# EAGLE design Nightlight Fan (EAGLE 8.4.3)
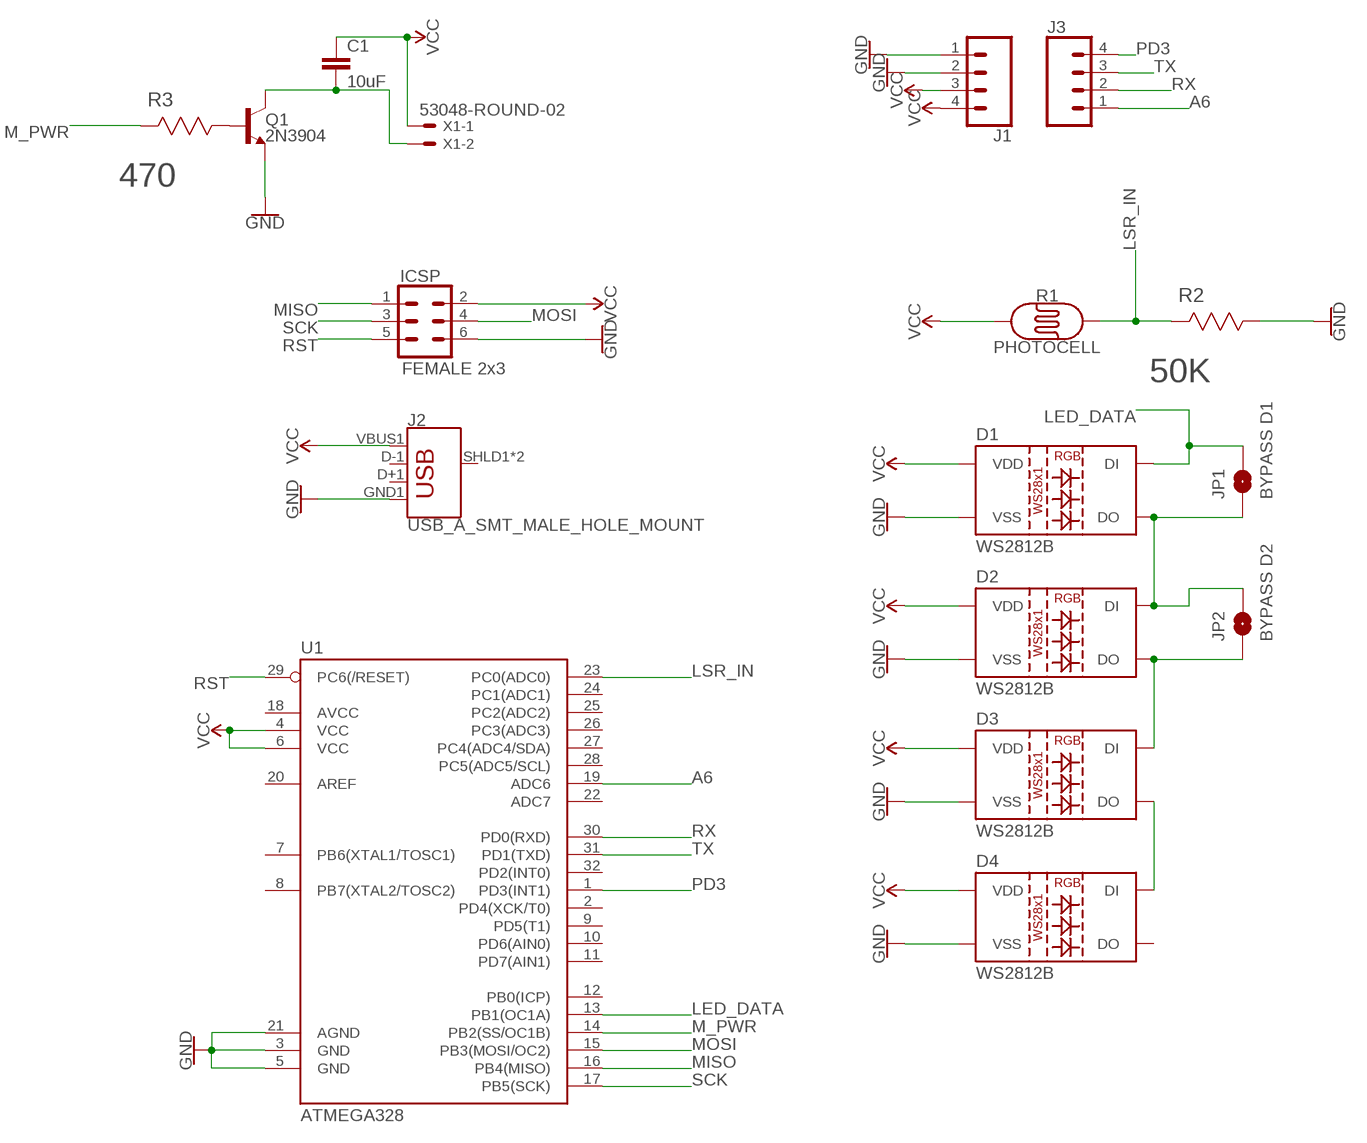
[diagram p0: schematic, sheet 1]

## Parts
C1  10uF  10UF-0805-10V-10%  [0805]
D1  WS2812B  [WS2812B]
D2  WS2812B  [WS2812B]
D3  WS2812B  [WS2812B]
D4  WS2812B  [WS2812B]
ICSP  FEMALE 2x3  CONN_03X22X3_SILK_MALE_PTH  [2X3]
J1  CONN_041X04_NO_SILK  [1X04_NO_SILK]
J2  USB_A_SMT_MALE_HOLE_MOUNT  [USB_A_SMT_MALE]
J3  CONN_041X04_NO_SILK  [1X04_NO_SILK]
JP1  BYPASS D1  JUMPER-SMT_2_NO_SILK  [SMT-JUMPER_2_NO_SILK]
JP2  BYPASS D2  JUMPER-SMT_2_NO_SILK  [SMT-JUMPER_2_NO_SILK]
Q1  2N3904  TRANS_NPN-MMBT2222AL  [SOT23-3]
R1  PHOTOCELL  PHOTOCELLPTH  [PHOTOCELL]
R2  50K  CRCW080510K0FKEA  [RESC2013X65N]
R3  470  CRCW0805470RFKEA  [RESC2013X65N]
U1  ATMEGA328  ATMEGA328P_TQFP  [TQFP32-08]
X1  53048-ROUND-02  [53048-02]

## Nets
A6: J3.1 U1.19(ADC6)
GND: D1.3(VSS) D2.3(VSS) D3.3(VSS) D4.3(VSS) ICSP.6 J1.1 J1.2 J2.GND1(GND) Q1.2(E) R2.1 U1.3(GND) U1.5(GND) U1.21(AGND)
LED_DATA: D1.4(DI) JP1.2 U1.13(PB1(OC1A))
LSR_IN: R1.2 R2.2 U1.23(PC0(ADC0))
M_PWR: R3.2 U1.14(PB2(SS/OC1B))
MISO: ICSP.1 U1.16(PB4(MISO))
MOSI: ICSP.4 U1.15(PB3(MOSI/OC2))
N$1: D1.2(DO) D2.4(DI) JP1.1 JP2.2
N$2: D2.2(DO) D3.4(DI) JP2.1
N$3: D3.2(DO) D4.4(DI)
N$4: Q1.1(B) R3.1
N$5: C1.2 Q1.3(C) X1.2
PD3: J3.4 U1.1(PD3(INT1))
RST: ICSP.5 U1.29(PC6(/RESET))
RX: J3.2 U1.30(PD0(RXD))
SCK: ICSP.3 U1.17(PB5(SCK))
TX: J3.3 U1.31(PD1(TXD))
VCC: C1.1 D1.1(VDD) D2.1(VDD) D3.1(VDD) D4.1(VDD) ICSP.2 J1.3 J1.4 J2.VBUS1(VBUS) R1.1 U1.4(VCC) U1.6(VCC) X1.1
Unconnected: D4.2(DO) J2.D+1(D+) J2.D-1(D-) J2.SHLD1(SHIELD) J2.SHLD2(SHIELD) U1.2(PD4(XCK/T0)) U1.7(PB6(XTAL1/TOSC1)) U1.8(PB7(XTAL2/TOSC2)) U1.9(PD5(T1)) U1.10(PD6(AIN0)) U1.11(PD7(AIN1)) U1.12(PB0(ICP)) U1.18(AVCC) U1.20(AREF) U1.22(ADC7) U1.24(PC1(ADC1)) U1.25(PC2(ADC2)) U1.26(PC3(ADC3)) U1.27(PC4(ADC4/SDA)) U1.28(PC5(ADC5/SCL)) U1.32(PD2(INT0))

## Library data of the parts
C1 = SparkFun-Capacitors:10UF: 10.0µF ceramic capacitors A capacitor is a passive two-terminal electrical component used to store electrical energy temporarily in an electric field.; PROD_ID: CAP-11330
D1-D4 = SparkFun-LED:WS2812B: WS2812B SMD addressable RGB LED 5x5mm SMD LED with built-in controller IC. Color: Red/Green/Blue mC Rating: RGB: 390, 660, 180 mcd Forward Voltage: RGB: 2.0, 3.0, 3.0 V Packages:WS2812B SparkFun Products: Blynk Board - ESP8266 <https://www.sparkfun.com/products/13794>; PROD_ID: DIO-12503
ICSP = SparkFun-Connectors:CONN_03X2: Multi connection point. Often used as Generic Header-pin footprint for 0.1 inch spaced/style header connections You can populate with any combo of single row headers, but if you'd like an exact match, check these: Header - 2x3 (Male, 0.1") <https://www.sparkfun.com/products/12807> (PRT-12807) Header - 2x3 (Female, 0.1") <https://www.sparkfun.com/products/13010> (PRT-13010) 2x3 Pin Shrouded Header <https://www.sparkfun.com/products/10877> (PRT-10877) On any of the 0.1 inch spaced packages, you can populate with these: Break Away Headers - Straight <https://www.sparkfun.com/products/116> (PRT-00116) Break Away Male Headers - Right Angle <https://www.sparkfun.com/products/553> (PRT-00553) Female Headers <https://www.sparkfun.com/products/115> (PRT-00115) Break Away Headers - Machine Pin <https://www.sparkfun.com/products/117> (PRT-00117) Break Away Female Headers - Swiss Machine Pin <https://www.sparkfun.com/products/743> (PRT-00743) Special note: the shrouded connector mates well with our 3x2 ribbon cables: Ribbon Crimp Connector - 6-pin (2x3, Female) <https://www.sparkfun.com/products/10651> (PRT-10651) Ribbon Cable - 6 wire (15ft) <https://www.sparkfun.com/products/10646> (PRT-10646); PROD_ID: CONN-09701
J1 J3 = SparkFun-Connectors:CONN_04: Multi connection point. Often used as Generic Header-pin footprint for 0.1 inch spaced/style header connections On any of the 0.1 inch spaced packages, you can populate with these: Break Away Headers - Straight <https://www.sparkfun.com/products/116> (PRT-00116) Break Away Male Headers - Right Angle <https://www.sparkfun.com/products/553> (PRT-00553) Female Headers <https://www.sparkfun.com/products/115> (PRT-00115) Break Away Headers - Machine Pin <https://www.sparkfun.com/products/117> (PRT-00117) Break Away Female Headers - Swiss Machine Pin <https://www.sparkfun.com/products/743> (PRT-00743) For SCREWTERMINALS and SPRING TERMINALS visit here: Screw Terimnals on SparkFun.com <https://www.sparkfun.com/search/results?term=Screw+Terminals> (5mm/3.5mm/2.54mm spacing) This device is also useful as a general connection point to wire up your design to another part of your project. Our various solder wires solder well into these plated through hole pads. Hook-Up Wire - Assortment (Stranded, 22 AWG) <https://www.sparkfun.com/products/11375> (PRT-11375) Hook-Up Wire - Assortment (Solid Core, 22 AWG) <https://www.sparkfun.com/products/11367> (PRT-11367) View the entire wire category on our website here <https://www.sparkfun.com/categories/141> Special notes: Molex polarized connector foot print use with SKU : PRT-08231 with associated crimp pins and housings. 1MM SMD Version SKU: PRT-10208; PROD_ID: CONN-09696
J2 = !CustomParts:USB_A_SMT_MALE_
JP1 JP2 = SparkFun-Jumpers:JUMPER-SMT_2_NO: Normally open jumper This jumper has two pads in close proximity to each other. Apply solder to close the connection. Round pads are easier to solder for beginners, but are a lot larger. SparkFun Product that uses the round pads: SparkFun EL Sequencer <https://www.sparkfun.com/products/12781>
Q1 = SparkFun-DiscreteSemi:TRANS_NPN: NPN transistor Current controlled devices typically used to amplify current or used as a switch. BC547 - COM-08928 <http://www.sparkfun.com/products/8928> (TO-92 45V 100mA) (1.Collector 2.Base 3.Emitter) 2N3904 - COM-00521 <http://www.sparkfun.com/products/521> (TO-92 40V 200mA) (1.Emitter 2.Base 3.Collector) P2N2222A - COM-12852 <http://www.sparkfun.com/products/12852> (TO-92 40V 600mA) (1.Collector 2.Base 3.Emitter); PROD_ID: TRANS-08049; VALUE: 600mA/40V
R1 = SparkFun-Sensors:PHOTOCELL: Photocell (Photodetector, Photo Resistor, CdS) This is a very small light sensor. A photocell changes (also called a photodetector, photo resistor, CdS or photoconductive cell) resistance depending on the amount of light it is exposed to. These little sensors make great ambient light triggers (when light in the room turns on, do something). Datasheet <http://cdn.sparkfun.com/datasheets/Sensors/LightImaging/SEN-09088.pdf> SparkFun Products Mini Photocell <https://www.sparkfun.com/products/9088> (SEN-09088); PROD_ID: COMP-09129; SF_ID: SEN-09088
R2 = Vishay_By_element14_Batch_1:CRCW080510K0FKEA: RESISTOR, 0805; MPN: CRCW080510K0FKEA; OC_FARNELL: 1469856; OC_NEWARK: 52K9796; SUPPLIER: Vishay; TOLERANCE: ±1%; VALUE: 10K Ohms; WATTAGE: 0.125 W
R3 = Vishay_By_element14_Batch_1:CRCW0805470RFKEA: RESISTOR, 0805; MPN: CRCW0805470RFKEA; OC_FARNELL: 1469932; OC_NEWARK: 42K4556; SUPPLIER: Vishay; TOLERANCE: ±1%; VALUE: 470 Ohms; WATTAGE: 0.125 W
U1 = SparkFun-IC-Microcontroller:ATMEGA328P_TQFP: Popular 328P in QFP Storefront component: ATmega328 - TQFP <https://www.sparkfun.com/products/13448> (COM-13448) Datasheet <http://www.sparkfun.com/datasheets/Components/SMD/ATMega328.pdf> SparkFun Products SparkFun RedBoard - Programmed with Arduino <https://www.sparkfun.com/products/12757> (DEV-12757) Arduino Pro Mini 328 - 5V/16MHz <https://www.sparkfun.com/products/11113> (DEV-11113) Arduino Pro Mini 328 - 3.3V/8MHz <https://www.sparkfun.com/products/11114> (DEV-11114) SparkFun OpenLog <https://www.sparkfun.com/products/13712> (DEV-13712) SparkFun MicroView - OLED Arduino Module <https://www.sparkfun.com/products/12923> (DEV-12923) SparkFun Digital Sandbox <https://www.sparkfun.com/products/12651> (DEV-12651) SparkFun PicoBoard <https://www.sparkfun.com/products/11888> (WIG-11888) Arduino Fio <https://www.sparkfun.com/products/10116> (DEV-10116) LilyPad Arduino 328 Main Board <https://www.sparkfun.com/products/13342> (DEV-13342) SparkFun RedStick <https://www.sparkfun.com/products/13741> (DEV-13741) LilyPad MP3 <https://www.sparkfun.com/products/11013> (DEV-11013) LilyPad Arduino SimpleSnap <https://www.sparkfun.com/products/10941> (DEV-10941) SparkFun Stepoko <https://www.sparkfun.com/products/13899> (ROB-13899) SparkFun Geiger Counter <https://www.sparkfun.com/products/11345> (SEN-11345) SparkFun EL Sequencer <https://www.sparkfun.com/products/12781> (COM-12781) Arduino Pro 328 - 5V/16MHz <https://www.sparkfun.com/products/10915> (DEV-10915) CryptoCape <https://www.sparkfun.com/products/12773> (DEV-12773) SparkFun IR Thermometer Evaluation Board - MLX90614 <https://www.sparkfun.com/products/10740> (SEN-10740) SparkFun RedBot Mainboard <https://www.sparkfun.com/products/12097> (ROB-12097) Arduino Pro 328 - 3.3V/8MHz <https://www.sparkfun.com/products/10914> (DEV-10914) SparkFun Block for Intel® Edison - Arduino <https://www.sparkfun.com/products/13036> (DEV-13036) SparkFun Simon Says - Surface Mount Soldering Kit <https://www.sparkfun.com/products/10935> (KIT-10935) SparkFun 7-Segment Serial Display - Red <https://www.sparkfun.com/products/11441> (COM-11441) SparkFun 7-Segment Serial Display - White <https://www.sparkfun.com/products/11629> (COM-11629) SparkFun 7-Segment Serial Display - Yellow <https://www.sparkfun.com/products/11443> (COM-11443) SparkFun 7-Segment Serial Display - Kelly Green <https://www.sparkfun.com/products/11440> (COM-11440) SparkFun 7-Segment Serial Display - Blue <https://www.sparkfun.com/products/11442> (COM-11442) SparkFun OpenSegment Serial Display - 20mm (Blue) <https://www.sparkfun.com/products/11647> (COM-11647) SparkFun OpenSegment Serial Display - 20mm (Green) <https://www.sparkfun.com/products/11646> (COM-11646) SparkFun OpenSegment Serial Display - 20mm (White) <https://www.sparkfun.com/products/11648> (COM-11648) SparkFun OpenSegment Serial Display - 20mm (Red) <https://www.sparkfun.com/products/11644> (COM-11644) SparkFun OpenSegment Serial Display - 20mm (Yellow) <https://www.sparkfun.com/products/11645> (COM-11645) SparkFun OpenSegment Shield <https://www.sparkfun.com/products/13190> (DEV-13190); PROD_ID: IC-09069; VALUE: ATMEGA328P_TQFP
X1 = !CustomParts:53?-02: CONNECTOR wire to board 1.25 mm (.049 inch) pitch header; MF: MOLEX; MPN: 53048-0210; OC_FARNELL: 1012259; OC_NEWARK: 57H4718

## Board
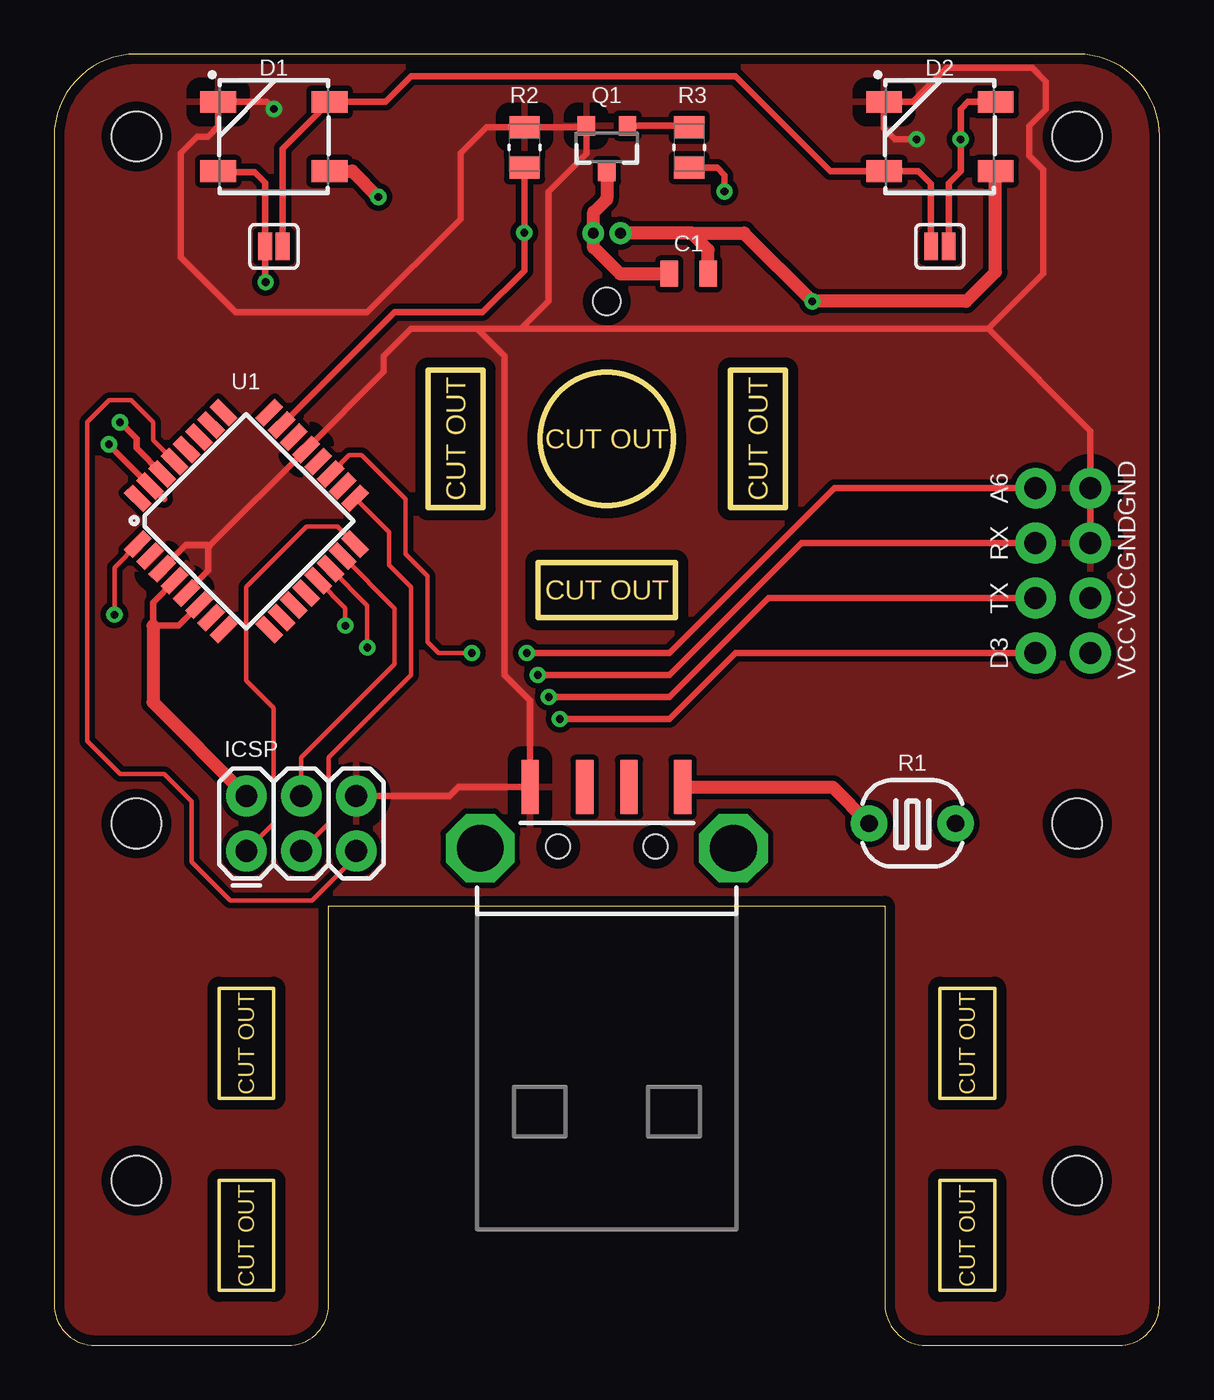
[diagram p1: board, top side]
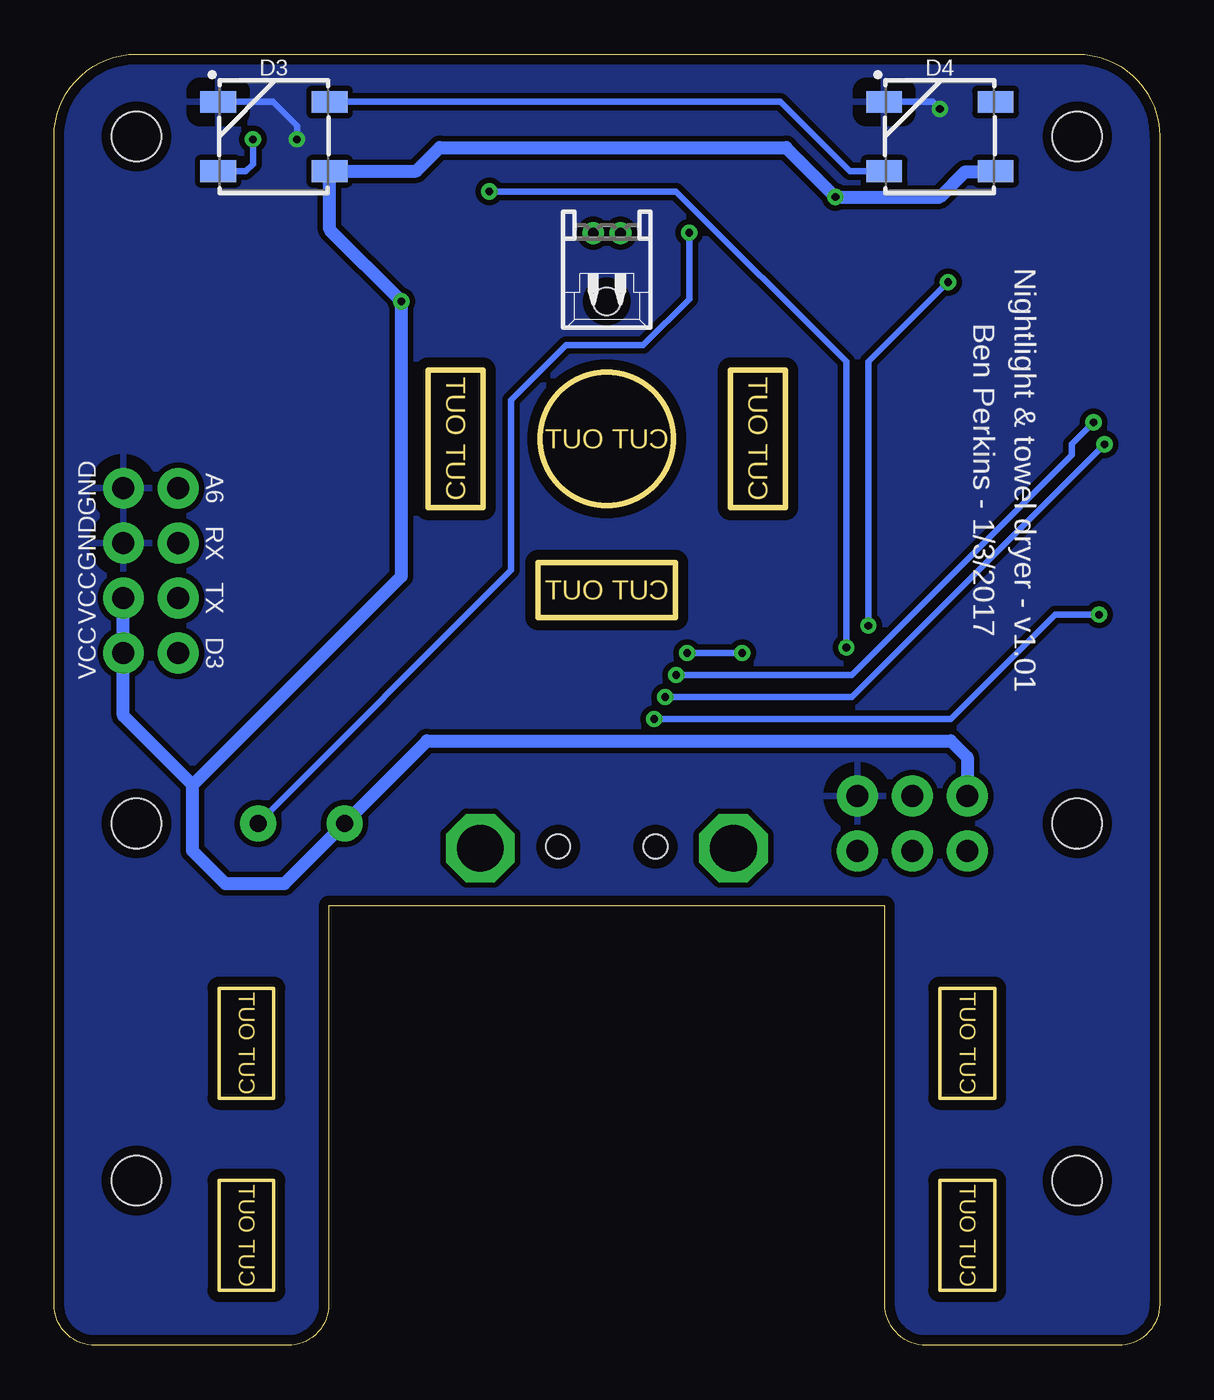
[diagram p2: board, bottom side, seen from below]

Size 51.1 x 59.69 mm. Coordinates in mm from the lower left corner, seen from the top.
Outline: 38.41,20.32 38.41,1.91 arc90 40.31,0 49.2,0 arc90 51.1,1.91 51.1,55.88 arc90 47.3,59.69 3.81,59.69 arc90 0,55.88 0,1.91 arc90 1.91,0 10.79,0 arc90 12.7,1.91 12.7,20.32 38.41,20.32
Outline: 10.16,2.54 7.62,2.54 7.62,7.62 10.16,7.62 10.16,2.54
Outline: 10.16,11.43 7.62,11.43 7.62,16.51 10.16,16.51 10.16,11.43
Outline: 43.48,2.54 40.95,2.54 40.95,7.62 43.48,7.62 43.48,2.54
Outline: 43.48,11.43 40.95,11.43 40.95,16.51 43.48,16.51 43.48,11.43
Outline: 31.27,45.09 33.81,45.09 33.81,38.73 31.27,38.73 31.27,45.09
Outline: 17.3,45.09 19.84,45.09 19.84,38.73 17.3,38.73 17.3,45.09
Outline: 22.38,33.66 22.38,36.2 28.73,36.2 28.73,33.66 22.38,33.66
Outline: circle at 25.55,41.91 radius 3.07
Copper layers (1*16): Top 0.035mm / dielectric 1.5mm / Bottom 0.035mm
Design rules "default *": minimum track width 6mil, minimum drill 0.35mm, track to track 10mil, track to pad 10mil, pad to pad 10mil, via to via 10mil, smd to smd 6mil, copper to edge 18mil, drill to drill 6mil, minimum pad ring 10mil, minimum via ring 8mil, stop-mask expansion 4mil, vias tented up to drill 0mil, thermal gap 25mil
Holes 2.29 mm at 3.81,55.88 3.81,24.13 3.81,7.62 47.29,55.88 47.29,24.13 47.29,7.62
Holes 1.27 mm at 25.55,48.26
tRestrict: area 5.3,34 to 5.8,34.5

### Footprints (pad centres in the part's own frame; a part is rotated, then mirrored left to right if it is on the bottom)
0805 = smd 0.8 x 1.2: 1 -0.9,0; 2 0.9,0
WS2812B = smd 1.651 x 1: 1 2.577,-1.6; 2 2.577,1.6; 3 -2.577,1.6; 4 -2.577,-1.6
2X3 = drill 1.016 pad 1.88: 1 0,0; 2 0,2.54; 3 2.54,0; 4 2.54,2.54; 5 5.08,0; 6 5.08,2.54
1X04_NO_SILK = drill 1.016 pad 1.88: 1 0,0; 2 2.54,0; 3 5.08,0; 4 7.62,0
USB_A_SMT_MALE = smd 2.5 x 0.8: D+1 10.95,1.027; D-1 10.95,-1.027; GND1 10.95,3.551; VBUS1 10.95,-3.5 | drill 2.159 pad 2.794 octagon: SHLD1 8.13,-5.85; SHLD2 8.13,5.85 | hole 1.1: 8.2,2.25; 8.2,-2.25
SMT-JUMPER_2_NO_SILK = smd 0.635 x 1.27: 1 -0.406,0; 2 0.406,0
SOT23-3 = smd 0.8 x 0.9: 1 -0.95,-1; 2 0.95,-1; 3 0,1.1
PHOTOCELL = drill 0.8 pad 1.676: 1 -2,0; 2 2,0
RESC2013X65N = smd 1.016 x 1.397: 1 -0.94,0; 2 0.94,0
TQFP32-08 = smd 1.27 x 0.559: 1 -4.293,2.8; 2 -4.293,2; 3 -4.293,1.2; 4 -4.293,0.4; 5 -4.293,-0.4; 6 -4.293,-1.2; 7 -4.293,-2; 8 -4.293,-2.8; 17 4.293,-2.8; 18 4.293,-2; 19 4.293,-1.2; 20 4.293,-0.4; 21 4.293,0.4; 22 4.293,1.2; 23 4.293,2; 24 4.293,2.8 | smd 0.559 x 1.27: 9 -2.8,-4.293; 10 -2,-4.293; 11 -1.2,-4.293; 12 -0.4,-4.293; 13 0.4,-4.293; 14 1.2,-4.293; 15 2,-4.293; 16 2.8,-4.293; 25 2.8,4.293; 26 2,4.293; 27 1.2,4.293; 28 0.4,4.293; 29 -0.4,4.293; 30 -1.2,4.293; 31 -2,4.293; 32 -2.8,4.293
53048-02 = drill 0.5 pad 0.864: 1 0.625,-1.25; 2 -0.625,-1.25

### Placement (x,y rotation side)
C1  29.34,49.53 180 top
D1  10.16,55.88 0 top
D2  40.94,55.88 0 top
D3  40.94,55.88 0 bottom
D4  10.16,55.88 0 bottom
ICSP  8.89,22.86 0 top
J1  47.9,39.62 270 top
J2  25.55,14.86 90 top
J3  45.36,39.62 270 top
JP1  10.16,50.8 180 top
JP2  40.94,50.8 180 top
Q1  25.55,55.37 180 top
R1  39.67,24.13 0 top
R2  21.74,55.37 270 top
R3  29.36,55.37 270 top
U1  8.89,38.1 45 top
X1  25.55,50.16 180 bottom

### Tracks (layer width: path | path; a pad name or v marks a point on that pad's centre or on a via)
A6  (via drill 0.35)
  Top 0.203: U1.19 13.63,41.15 14.22,41.15 16.26,39.12 16.26,36.58 17.27,35.56 17.27,32.51 17.78,32 v19.3,32
  Top 0.305: 13.21,40.64 U1.19 | J3.1 36.07,39.62 28.45,32 v21.84,32
  Bottom 0.305: v19.3,32 v21.84,32
GND  (via drill 0.35)
  Top 0.305: 7.21,36.99 U1.21 15.24,45.02 15.24,45.72 16.51,46.99 19.56,46.99 | 7.21,36.99 7.11,36.89 7.11,35.81 6.14,34.84 U1.5 | U1.3 6.08,36.99 7.21,36.99 | 19.56,46.99 21.59,46.99 | 21.59,46.99 22.86,48.26 22.86,53.34 24.6,55.08 Q1.2 24.39,56.31 R2.1 19.99,56.31 18.8,55.12 18.8,52.07 14.48,47.75 8.38,47.75 5.84,50.29 5.84,55.12 6.6,55.88 7.11,55.88 7.58,56.35 D1.3 9.83,57.48 v10.16,57.15 | 21.59,46.99 43.18,46.99 | 43.18,46.99 45.72,49.53 45.72,54.36 45.09,54.99 45.09,56.39 45.85,57.15 45.85,58.42 45.21,59.05 41.27,59.05 39.7,57.48 D2.3 38.35,57.47 38.35,56.26 38.86,55.75 v39.88,55.75 | 43.18,46.99 47.9,42.27 J1.1 J1.2 | 19.56,46.99 20.83,45.72 20.83,30.99 22,29.81 J2.GND1 18.7,25.81 18.29,25.4 ICSP.6
  Bottom 0.305: v10.16,57.15 10.49,57.48 D4.3 | v39.88,55.75 39.88,56.39 40.97,57.48 D3.3
  pour Top: 0,0 52.07,0 52.07,59.69 0,59.69
  pour Bottom: -1.27,0 53.34,0 53.34,59.69 -1.27,59.69
LED_DATA  (via drill 0.35)
  Top 0.203: U1.13 13.46,34.09 v13.46,33.27
  Top 0.305: v9.78,49.15 9.75,49.17 JP1.2 9.75,53.75 9.27,54.23 7.63,54.23 D1.4
  Bottom 0.305: v13.46,33.27 13.46,45.47 v9.78,49.15
LSR_IN  (via drill 0.35)
  Top 0.305: U1.23 15.73,47.77 15.75,47.75 19.81,47.75 21.74,49.68 v21.74,51.44 R2.2
  Bottom 0.305: R1.2 29.97,35.83 29.97,43.69 27.43,46.23 23.88,46.23 21.74,48.36 v21.74,51.44
M_PWR  (via drill 0.35)
  Top 0.203: U1.14 14.48,34.21 v14.48,32.26
  Top 0.305: R3.2 30.66,54.43 30.99,54.1 v30.99,53.34
  Bottom 0.305: v14.48,32.26 14.48,45.47 22.35,53.34 v30.99,53.34
MISO
  Top 0.203: ICSP.1 10.16,24.13 10.16,29.46 8.89,30.73 8.89,35.05 11.68,37.85 13.1,37.85 U1.16
MOSI
  Top 0.203: ICSP.4 11.43,27.18 15.75,31.5 15.75,34.07 U1.15
N$1
  Top 0.305: JP1.1 10.57,55.31 D1.2 15.32,57.48 16.51,58.67 31.5,58.67 35.89,54.28 D2.4 39.95,54.28 40.54,53.7 JP2.2
N$2  (via drill 0.35)
  Top 0.305: 43.47,57.53 D2.2 | 43.56,57.44 D2.2 | D2.2 42.24,57.48 41.91,57.15 v41.91,55.75 41.91,54.28 41.35,53.72 JP2.1
  Bottom 0.305: 43.56,54.32 D3.4 42.24,54.28 41.91,54.61 v41.91,55.75
N$3
  Bottom 0.305: D3.2 17.53,57.48 14.33,54.28 D4.4
N$4
  Top 0.305: Q1.1 29.15,56.37 R3.1
N$5
  Top 0.61: C1.2 26.16,49.53 24.97,50.72 arc-45 24.93,50.83 X1.2 24.93,52.3 arc-45 24.97,52.4 25.51,52.94 arc45 25.55,53.05 Q1.3
PD3  (via drill 0.35)
  Top 0.203: U1.1 2.79,35.96 v2.79,33.78
  Top 0.305: v23.37,28.96 28.45,28.96 31.5,32 J3.4
  Bottom 0.305: v23.37,28.96 9.65,28.96 4.83,33.78 v2.79,33.78
RST
  Top 0.203: 13.97,22.61 11.94,20.57 8.13,20.57 6.35,22.35 6.35,25.15 5.08,26.42 3.05,26.42 1.52,27.94 1.52,42.67 2.54,43.69 3.56,43.69 4.57,42.67 4.57,41.85 U1.29
  Top 0.305: ICSP.5 13.97,22.61
RX  (via drill 0.35)
  Top 0.305: J3.2 34.54,37.08 28.45,30.99 v22.35,30.99 | 5.08,40.13 U1.30 3.81,41.48 3.81,41.91 v3.05,42.67
  Bottom 0.305: v22.35,30.99 14.22,30.99 4.06,41.15 4.06,41.66 v3.05,42.67
SCK
  Top 0.203: ICSP.3 12.7,24.13 12.7,27.18 16.51,30.99 16.51,35.05 15.49,36.07 15.49,37.59 13.93,39.16
  Top 0.305: 13.93,39.16 U1.17
TX  (via drill 0.35)
  Top 0.305: J3.3 33.02,34.54 28.45,29.97 v22.86,29.97 | 5.08,39.12 4.57,39.62 U1.31 2.54,41.62 v2.54,41.66
  Bottom 0.305: v22.86,29.97 14.22,29.97 v2.54,41.66
VCC  (via drill 0.35)
  Top 0.305: 5.57,35.29 U1.4 4.57,34.35 4.57,33.27 5.76,33.27 U1.6
  Top 0.61: ICSP.2 4.57,29.72 4.57,33.27 | D2.1 43.52,49.62 42.16,48.26 v35.05,48.26 31.9,51.41 29.46,51.41 | D1.1 13.79,54.28 v14.99,53.09 | 29.46,51.41 X1.1 | C1.1 30.24,50.64 29.46,51.41 | J2.VBUS1 36,25.81 R1.1
  Bottom 0.61: ICSP.2 8.89,27.18 9.65,27.94 33.87,27.94 R1.1 40.47,21.34 43.18,21.34 44.7,22.86 44.7,25.91 | D4.1 7.62,54.24 9,54.24 10.16,53.09 v14.99,53.09 17.27,55.37 33.27,55.37 34.37,54.28 D3.1 38.37,51.58 v35.05,48.26 35.05,35.56 44.7,25.91 | 44.7,25.91 47.9,29.11 J1.4 J1.3

### Text on the board
Dimension: CUT OUT | CUT OUT | CUT OUT | CUT OUT | CUT OUT | CUT OUT | CUT OUT | CUT OUT
tPlace: A6 | GND | RX | GND | TX | VCC | D3 | VCC
bPlace: Nightlight & towel dryer - v1.01 | Ben Perkins - 1/3/2017 | A6 | GND | RX | GND | TX | VCC | D3 | VCC